# Altium schematic sheet GSM IoT Block Diagram.SchDoc: GSM IoT Block Diagram
size 292 x 193 mm; SheetNumber: 1; SheetTotal: 14
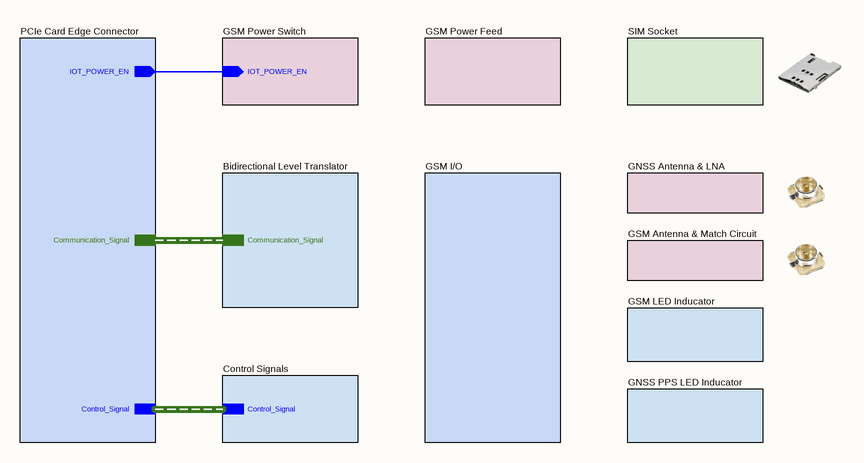
[diagram p0: GSM IoT Block Diagram.SchDoc]

## Sub-sheets
Bidirectional Level Translator = Voltage Translator.SchDoc: Communication_Signal (harness Communication_Signal)
Control Signals = Signal Control Block.SchDoc: Control_Signal (harness Control_Signal)
GNSS Antenna & LNA = GNSS Antenna.SchDoc: no entries
GNSS PPS LED Inducator = GNSS PPS LED Driver.SchDoc: no entries
GSM Antenna & Match Circuit = GSM Antenna.SchDoc: no entries
GSM I/O = GSM Un Used.SchDoc: no entries
GSM LED Inducator = GSM Stat LED Driver.SchDoc: no entries
GSM Power Feed = GSM Modem Power Feed.SchDoc: no entries
GSM Power Switch = GSM Power Switch.SchDoc: IOT_POWER_EN (in)
PCIe Card Edge Connector = Card Edge Connector.SchDoc: IOT_POWER_EN (out), Control_Signal (harness Control_Signal), Communication_Signal (harness Communication_Signal)
SIM Socket = SIM Socket.SchDoc: no entries

## Nets
(unnamed): sheet GSM Power Switch/IOT_POWER_EN, sheet PCIe Card Edge Connector/IOT_POWER_EN

## Buses and harness runs
harness sheet Bidirectional Level Translator/Communication_Signal = sheet PCIe Card Edge Connector/Communication_Signal
harness sheet Control Signals/Control_Signal = sheet PCIe Card Edge Connector/Control_Signal

## Notes on the sheet
- © 2021 All rights reserved.
  This document may not, in whole or in part, be copied, photocopied, reproduced, translated or converted to any electronic or machine readable from without prior written permission of Mehmet Günce Akkoyun.
  Engineer contact : akkoyun@me.com
- Property of
- Engineer :
- Date :
- Size :
- A4
- Time :
- Project :
- Page :
- /
- Customer :
- Product ID :
- Module ID :
- Version :
- File :
- Revision :